# Altium project main board_Project.PrjPCB
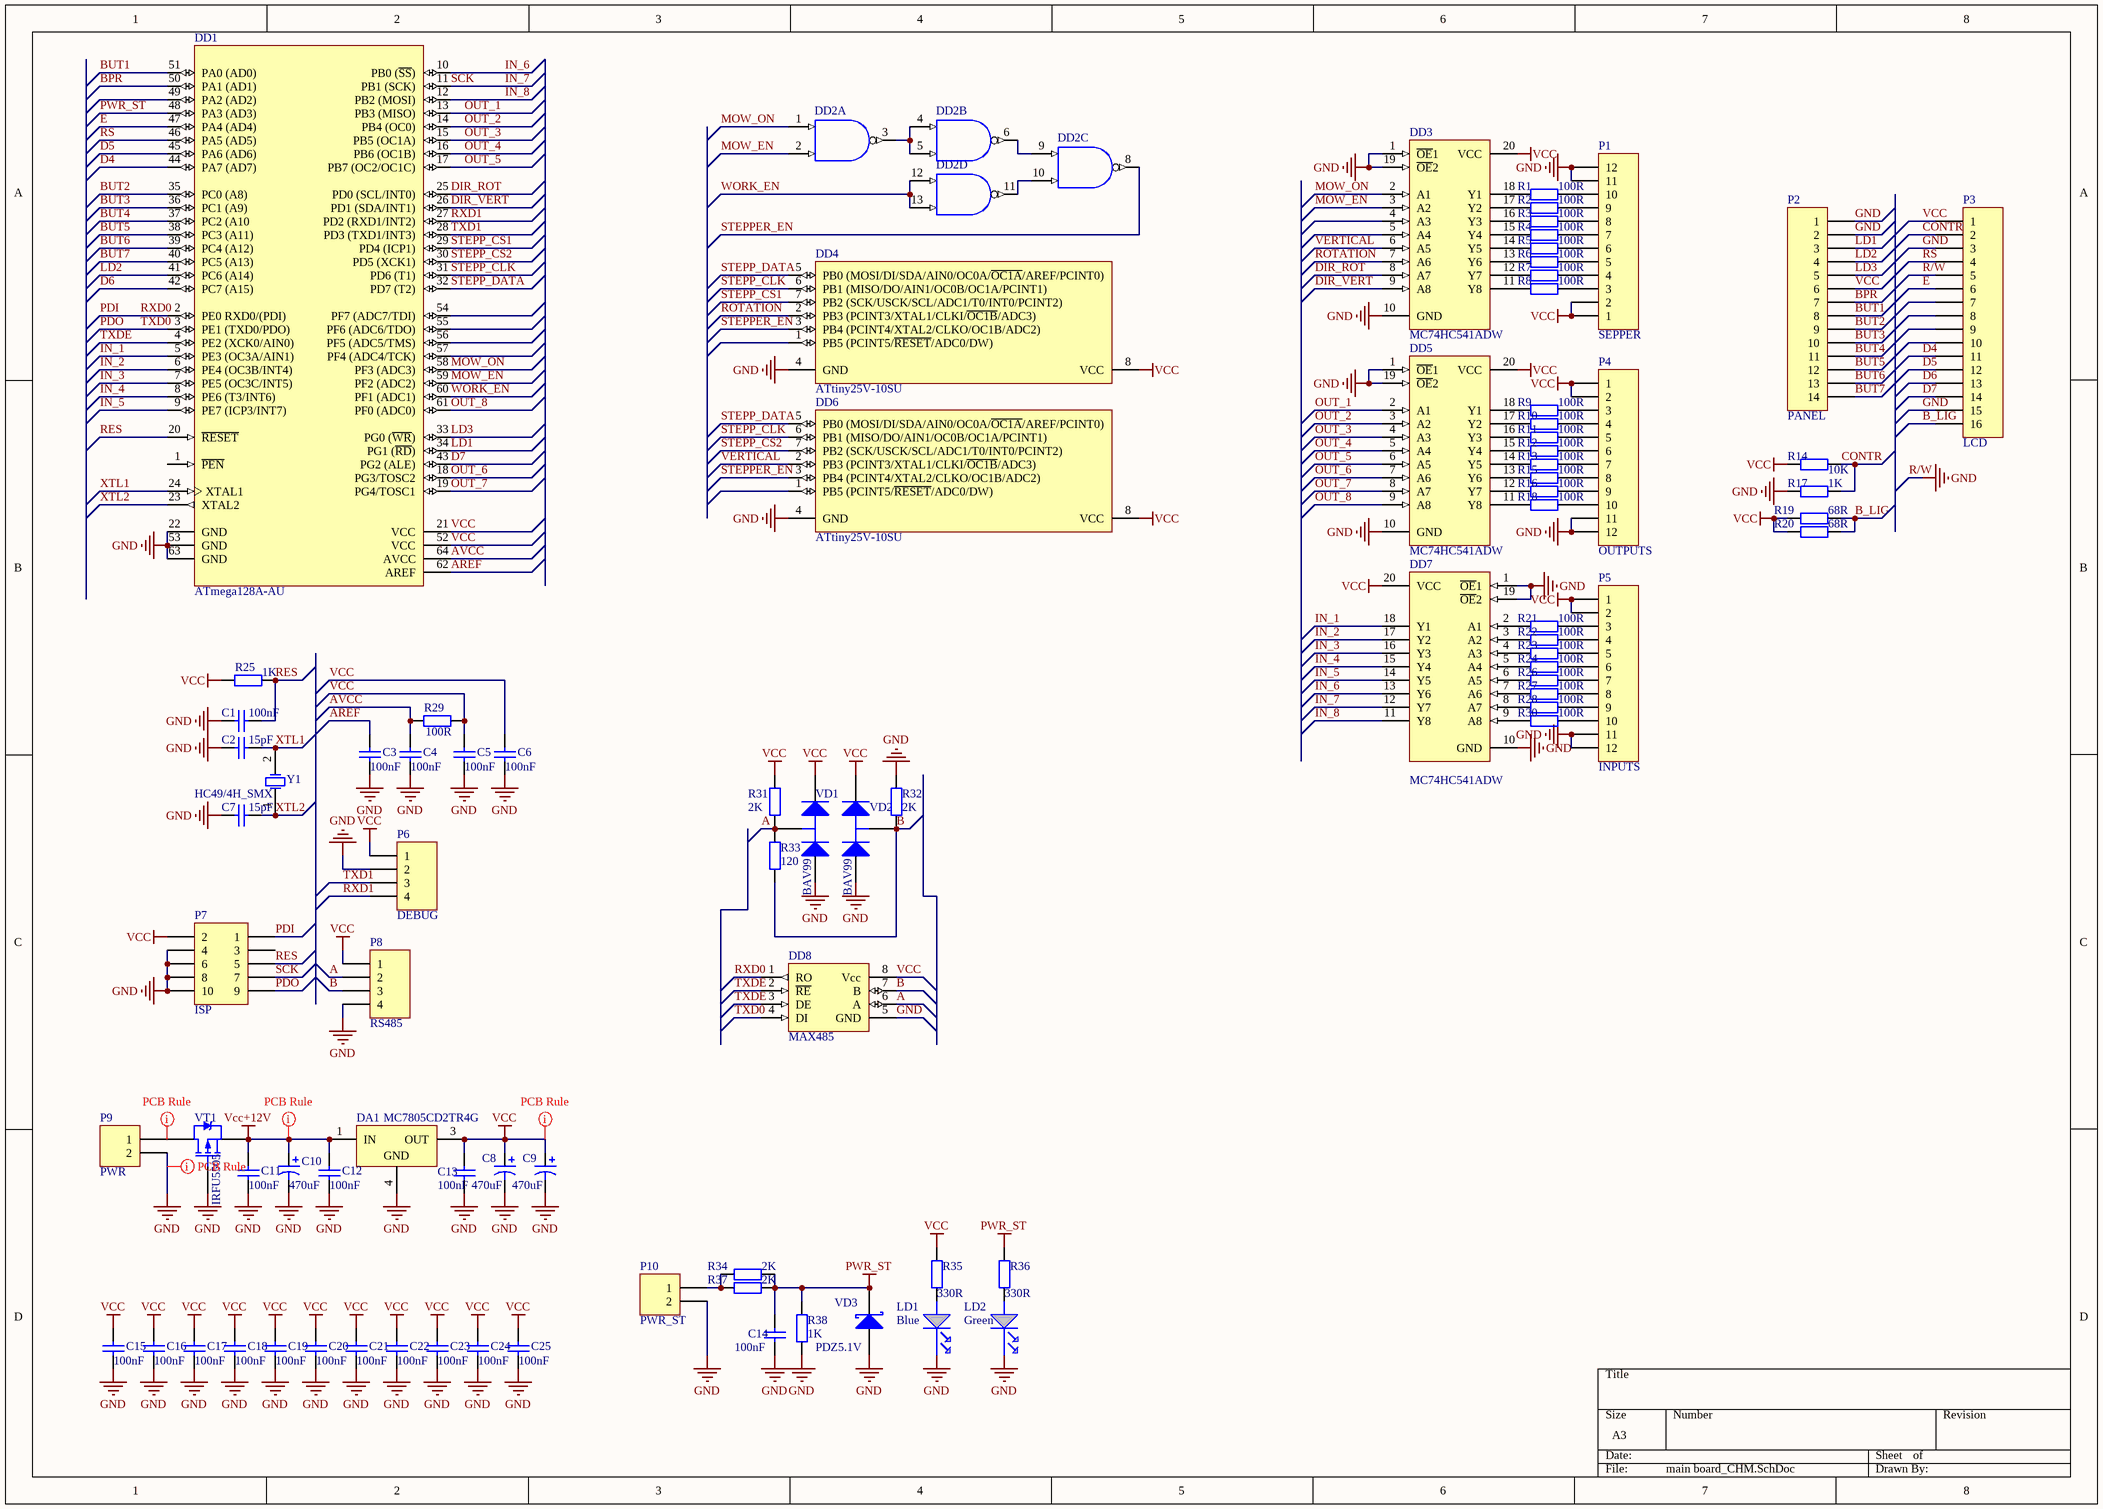
[diagram p0: main board_CHM.SchDoc]
1 sheet, 89 parts. Net scope: global (net labels, ports and power ports of the same name join across sheets).
Board file: main board_PCB.PcbDoc

## Sheet main board_CHM.SchDoc
size A3; PageSetup: Record=PageOptions|CenterHorizontal=True|CenterVertical=True|PrintScale=1.03|XCorrection=1.00|YCorrection=1.00|PrintKind=1|BorderSize=5000000|LeftOffset=0|BottomOffset=0|Orientation=2|PaperLength=1000|PaperWidth=1000|Scale=100|PaperSource=15|PrintQuality=600|MediaType=1|DitherType=10|PaperKind=A3|PrintScaleMode=1

### Parts
C1  value 100nF  [CAPC2012X135N]  (hidden comment: C0805)
C2  value 15pF  [CAPC2012X135N]  (hidden comment: C0805)
C3  value 100nF  [CAPC2012X135N]  (hidden comment: C0805)
C4  value 100nF  [CAPC2012X135N]  (hidden comment: C0805)
C5  value 100nF  [CAPC2012X135N]  (hidden comment: C0805)
C6  value 100nF  [CAPC2012X135N]  (hidden comment: C0805)
C7  value 15pF  [CAPC2012X135N]  (hidden comment: C0805)
C8  value 470uF  [CAPAE200P550X1200_FLAT1]  (hidden comment: Cap Pol1)
C9  value 470uF  [CAPAE200P550X1200_FLAT1]  (hidden comment: Cap Pol1)
C10  value 470uF  [CAPAE200P550X1200_FLAT1]  (hidden comment: Cap Pol1)
C11  value 100nF  [CAPC2012X135N]  (hidden comment: C0805)
C12  value 100nF  [CAPC2012X135N]  (hidden comment: C0805)
C13  value 100nF  [CAPC2012X135N]  (hidden comment: C0805)
C14  value 100nF  [CAPC2012X135N]  (hidden comment: C0805)
C15  value 100nF  [CAPC2012X135N]  (hidden comment: C0805)
C16  value 100nF  [CAPC2012X135N]  (hidden comment: C0805)
C17  value 100nF  [CAPC2012X135N]  (hidden comment: C0805)
C18  value 100nF  [CAPC2012X135N]  (hidden comment: C0805)
C19  value 100nF  [CAPC2012X135N]  (hidden comment: C0805)
C20  value 100nF  [CAPC2012X135N]  (hidden comment: C0805)
C21  value 100nF  [CAPC2012X135N]  (hidden comment: C0805)
C22  value 100nF  [CAPC2012X135N]  (hidden comment: C0805)
C23  value 100nF  [CAPC2012X135N]  (hidden comment: C0805)
C24  value 100nF  [CAPC2012X135N]  (hidden comment: C0805)
C25  value 100nF  [CAPC2012X135N]  (hidden comment: C0805)
DA1  MC7805CD2TR4G  [TO-252]
DD1  ATmega128A-AU  [64A_N]
DD2  MC74HC00AD  [SOIC127P600X175-14AN]  (value not drawn)  (parts A,B,C,D of 4)
DD3  MC74HC541ADW  [751D-05_N]
DD4  ATtiny25V-10SU  [8S2_N]
DD5  MC74HC541ADW  [751D-05_N]
DD6  ATtiny25V-10SU  [8S2_N]
DD7  MC74HC541ADW  [751D-05_N]
DD8  MAX485  [S8S1_M]
LD1  value Blue  [LED-0603-BLUE]  (hidden comment: PWR_L)
LD2  value Green  [LED-0603-GREEN]  (hidden comment: PWR_H)
P1  SEPPER  [12P_PCB_ScrewTerm_90S_3.81MM]
P2  PANEL  [14P_PCB_HEADER_BRD_MNT]
P3  LCD  [16P_PCB_HEADER_BRD_MNT]
P4  OUTPUTS  [12P_PCB_ScrewTerm_90S_3.81MM]
P5  INPUTS  [12P_PCB_ScrewTerm_90S_3.81MM]
P6  DEBUG  [HDR1X4]
P7  ISP  [10P_PCB_HEADER_BRD_MNT]
P8  RS485  [4P_PCB_ScrewTerm_90S_3.81MM]
P9  PWR  [2P_PCB_ScrewTerm_90S_3.81MM]
P10  PWR_ST  [2P_PCB_ScrewTerm_90S_3.81MM]
R1  value 100R  [RESC3216X70N]  (hidden comment: Res2)
R2  value 100R  [RESC3216X70N]  (hidden comment: Res2)
R3  value 100R  [RESC3216X70N]  (hidden comment: Res2)
R4  value 100R  [RESC3216X70N]  (hidden comment: Res2)
R5  value 100R  [RESC3216X70N]  (hidden comment: Res2)
R6  value 100R  [RESC3216X70N]  (hidden comment: Res2)
R7  value 100R  [RESC3216X70N]  (hidden comment: Res2)
R8  value 100R  [RESC3216X70N]  (hidden comment: Res2)
R9  value 100R  [RESC3216X70N]  (hidden comment: Res2)
R10  value 100R  [RESC3216X70N]  (hidden comment: Res2)
R11  value 100R  [RESC3216X70N]  (hidden comment: Res2)
R12  value 100R  [RESC3216X70N]  (hidden comment: Res2)
R13  value 100R  [RESC3216X70N]  (hidden comment: Res2)
R14  value 10K  [RESC2012X70N]  (hidden comment: Res2)
R15  value 100R  [RESC3216X70N]  (hidden comment: Res2)
R16  value 100R  [RESC3216X70N]  (hidden comment: Res2)
R17  value 1K  [RESC2012X70N]  (hidden comment: Res2)
R18  value 100R  [RESC3216X70N]  (hidden comment: Res2)
R19  value 68R  [RESC3216X70N]  (hidden comment: Res2)
R20  value 68R  [RESC3216X70N]  (hidden comment: Res2)
R21  value 100R  [RESC3216X70N]  (hidden comment: Res2)
R22  value 100R  [RESC3216X70N]  (hidden comment: Res2)
R23  value 100R  [RESC3216X70N]  (hidden comment: Res2)
R24  value 100R  [RESC3216X70N]  (hidden comment: Res2)
R25  value 1K  [RESC2012X70N]  (hidden comment: Res2)
R26  value 100R  [RESC3216X70N]  (hidden comment: Res2)
R27  value 100R  [RESC3216X70N]  (hidden comment: Res2)
R28  value 100R  [RESC3216X70N]  (hidden comment: Res2)
R29  value 100R  [RESC2012X70N]  (hidden comment: Res2)
R30  value 100R  [RESC3216X70N]  (hidden comment: Res2)
R31  value 2K  [RESC2012X70N]  (hidden comment: Res2)
R32  value 2K  [RESC2012X70N]  (hidden comment: Res2)
R33  value 120  [RESC2012X70N]  (hidden comment: Res2)
R34  value 2K  [RESC3216X70N]  (hidden comment: Res2)
R35  value 330R  [RESC2012X70N]  (hidden comment: Res2)
R36  value 330R  [RESC2012X70N]  (hidden comment: Res2)
R37  value 2K  [RESC3216X70N]  (hidden comment: Res2)
R38  value 1K  [RESC2012X70N]  (hidden comment: Res2)
VD1  BAV99  [SOT23-3]
VD2  BAV99  [SOT23-3]
VD3  PDZ5.1V  [SOD323]
VT1  IRFU5505  [TO-252]
Y1  HC49/4H_SMX  [CRYSTAL_HC49-US-SM]

### Nets
GND: C1.1 C2.1 C3.1 C4.1 C5.1 C6.1 C7.1 C8.2 C9.2 C10.2 C11.1 C12.1 C13.1 C14.1 C15.1 C16.1 C17.1 C18.1 C19.1 C20.1 C21.1 C22.1 C23.1 C24.1 C25.1 DA1.4(GND) DD1.22(GND) DD1.53(GND) DD1.63(GND) DD2.7(GND) DD3.1(~{OE}1) DD3.10(GND) DD3.19(~{OE}2) DD4.4(GND) DD5.1(~{OE}1) DD5.10(GND) DD5.19(~{OE}2) DD6.4(GND) DD7.1(~{OE}1) DD7.10(GND) DD7.19(~{OE}2) DD8.5(GND) LD1.K(CATODE) LD2.K(CATODE) P1.11 P1.12 P2.1 P2.2 P3.3 P3.5 P3.15 P4.11 P4.12 P5.11 P5.12 P6.2 P7.4 P7.6 P7.8 P7.10 P8.4 P9.2 P10.2 R17.1 R32.1 R38.1 VD1.1(A) VD2.1(A) VD3.2(A) VT1.1(G)  [also labelled R/W]
PWR_ST: C14.2 DD1.48(PA3_(AD3)) R34.2 R36.2 R37.2 R38.2 VD3.1(K)
VCC: C5.2 C6.2 C8.1 C9.1 C13.2 C15.2 C16.2 C17.2 C18.2 C19.2 C20.2 C21.2 C22.2 C23.2 C24.2 C25.2 DA1.3(OUT) DD1.21(VCC) DD1.52(VCC) DD2.14(VCC) DD3.20(VCC) DD4.8(VCC) DD5.20(VCC) DD6.8(VCC) DD7.20(VCC) DD8.8(Vcc) P1.1 P1.2 P2.6 P3.1 P4.1 P4.2 P5.1 P5.2 P6.1 P7.2 P8.1 R14.1 R19.1 R20.1 R25.1 R29.2 R31.2 R35.2 VD1.2(K) VD2.2(K)
Vcc+12V: C10.1 C11.2 C12.2 DA1.1(IN) VT1.3(S)
A: DD8.6(A) P8.2 R31.1 R33.1 VD1.3(C)
AREF: C3.2 DD1.62(AREF)
AVCC: C4.2 DD1.64(AVCC) R29.1
B: DD8.7(B) P8.3 R32.2 R33.2 VD2.3(C)
B_LIG: P3.16 R19.2 R20.2
BPR: DD1.50(PA1_(AD1)) P2.7
BUT1: DD1.51(PA0_(AD0)) P2.8
BUT2: DD1.35(PC0_(A8)) P2.9
BUT3: DD1.36(PC1_(A9)) P2.10
BUT4: DD1.37(PC2_(A10) P2.11
BUT5: DD1.38(PC3_(A11)) P2.12
BUT6: DD1.39(PC4_(A12)) P2.13
BUT7: DD1.40(PC5_(A13)) P2.14
CONTR: P3.2 R14.2 R17.2
D4: DD1.44(PA7_(AD7)) P3.11
D5: DD1.45(PA6_(AD6)) P3.12
D6: DD1.42(PC7_(A15)) P3.13
D7: DD1.43(PG2_(ALE)) P3.14
DIR_ROT: DD1.25(PD0_(SCL/INT0)) DD3.8(A7)
DIR_VERT: DD1.26(PD1_(SDA/INT1)) DD3.9(A8)
E: DD1.47(PA4_(AD4)) P3.6
IN_1: DD1.5(PE3_(OC3A/AIN1)) DD7.18(Y1)
IN_2: DD1.6(PE4_(OC3B/INT4)) DD7.17(Y2)
IN_3: DD1.7(PE5_(OC3C/INT5)) DD7.16(Y3)
IN_4: DD1.8(PE6_(T3/INT6)) DD7.15(Y4)
IN_5: DD1.9(PE7_(ICP3/INT7)) DD7.14(Y5)
IN_6: DD1.10(PB0_(~{SS})) DD7.13(Y6)
IN_7: DD1.11(PB1_(SCK)) DD7.12(Y7) P7.7  [also labelled SCK]
IN_8: DD1.12(PB2_(MOSI)) DD7.11(Y8)
LD1: DD1.34(PG1_(~{RD})) P2.3
LD2: DD1.41(PC6_(A14)) P2.4
LD3: DD1.33(PG0_(~{WR})) P2.5
MOW_EN: DD1.59(PF2_(ADC2)) DD2.2(B) DD3.3(A2)
MOW_ON: DD1.58(PF3_(ADC3)) DD2.1(A) DD3.2(A1)
OUT_1: DD1.13(PB3_(MISO)) DD5.2(A1)
OUT_2: DD1.14(PB4_(OC0)) DD5.3(A2)
OUT_3: DD1.15(PB5_(OC1A)) DD5.4(A3)
OUT_4: DD1.16(PB6_(OC1B)) DD5.5(A4)
OUT_5: DD1.17(PB7_(OC2/OC1C)) DD5.6(A5)
OUT_6: DD1.18(PG3/TOSC2) DD5.7(A6)
OUT_7: DD1.19(PG4/TOSC1) DD5.8(A7)
OUT_8: DD1.61(PF0_(ADC0)) DD5.9(A8)
PDI: DD1.2(PE0_RXD0/(PDI)) DD8.1(RO) P7.1  [also labelled RXD0]
PDO: DD1.3(PE1_(TXD0/PDO)) DD8.4(DI) P7.9  [also labelled TXD0]
RES: C1.2 DD1.20(~{RESET}) P7.5 R25.2
ROTATION: DD3.7(A6) DD4.2(PB3_(PCINT3/XTAL1/CLKI/~{OC1B}/ADC3))
RS: DD1.46(PA5_(AD5)) P3.4
RXD1: DD1.27(PD2_(RXD1/INT2)) P6.4
STEPP_CLK: DD1.31(PD6_(T1)) DD4.6(PB1_(MISO/DO/AIN1/OC0B/OC1A/PCINT1)) DD6.6(PB1_(MISO/DO/AIN1/OC0B/OC1A/PCINT1))
STEPP_CS1: DD1.29(PD4_(ICP1)) DD4.7(PB2_(SCK/USCK/SCL/ADC1/T0/INT0/PCINT2))
STEPP_CS2: DD1.30(PD5_(XCK1)) DD6.7(PB2_(SCK/USCK/SCL/ADC1/T0/INT0/PCINT2))
STEPP_DATA: DD1.32(PD7_(T2)) DD4.5(PB0_(MOSI/DI/SDA/AIN0/OC0A/~{OC1A}/AREF/PCINT0)) DD6.5(PB0_(MOSI/DI/SDA/AIN0/OC0A/~{OC1A}/AREF/PCINT0))
STEPPER_EN: DD2.8(~{Y}) DD4.3(PB4_(PCINT4/XTAL2/CLKO/OC1B/ADC2)) DD6.3(PB4_(PCINT4/XTAL2/CLKO/OC1B/ADC2))
TXD1: DD1.28(PD3_(TXD1/INT3)) P6.3
TXDE: DD1.4(PE2_(XCK0/AIN0)) DD8.2(~{RE}) DD8.3(DE)
VERTICAL: DD3.6(A5) DD6.2(PB3_(PCINT3/XTAL1/CLKI/~{OC1B}/ADC3))
WORK_EN: DD1.60(PF1_(ADC1)) DD2.12(A) DD2.13(B)
XTL1: C2.2 DD1.24(XTAL1) Y1.2(OSC2)
XTL2: C7.2 DD1.23(XTAL2) Y1.1(OSC1)
NetDD2_3: DD2.3(~{Y}) DD2.4(A) DD2.5(B)
NetDD2_6: DD2.6(~{Y}) DD2.9(A)
NetDD2_10: DD2.10(B) DD2.11(~{Y})
NetDD3_11: DD3.11(Y8) R8.1
NetDD3_12: DD3.12(Y7) R7.1
NetDD3_13: DD3.13(Y6) R6.1
NetDD3_14: DD3.14(Y5) R5.1
NetDD3_15: DD3.15(Y4) R4.1
NetDD3_16: DD3.16(Y3) R3.1
NetDD3_17: DD3.17(Y2) R2.1
NetDD3_18: DD3.18(Y1) R1.1
NetDD5_11: DD5.11(Y8) R18.1
NetDD5_12: DD5.12(Y7) R16.1
NetDD5_13: DD5.13(Y6) R15.1
NetDD5_14: DD5.14(Y5) R13.1
NetDD5_15: DD5.15(Y4) R12.1
NetDD5_16: DD5.16(Y3) R11.1
NetDD5_17: DD5.17(Y2) R10.1
NetDD5_18: DD5.18(Y1) R9.1
NetDD7_2: DD7.2(A1) R21.1
NetDD7_3: DD7.3(A2) R22.1
NetDD7_4: DD7.4(A3) R23.1
NetDD7_5: DD7.5(A4) R24.1
NetDD7_6: DD7.6(A5) R26.1
NetDD7_7: DD7.7(A6) R27.1
NetDD7_8: DD7.8(A7) R28.1
NetDD7_9: DD7.9(A8) R30.1
NetLD1_A: LD1.A(ANODE) R35.1
NetLD2_A: LD2.A(ANODE) R36.1
NetP1_3: P1.3 R8.2
NetP1_4: P1.4 R7.2
NetP1_5: P1.5 R6.2
NetP1_6: P1.6 R5.2
NetP1_7: P1.7 R4.2
NetP1_8: P1.8 R3.2
NetP1_9: P1.9 R2.2
NetP1_10: P1.10 R1.2
NetP4_3: P4.3 R9.2
NetP4_4: P4.4 R10.2
NetP4_5: P4.5 R11.2
NetP4_6: P4.6 R12.2
NetP4_7: P4.7 R13.2
NetP4_8: P4.8 R15.2
NetP4_9: P4.9 R16.2
NetP4_10: P4.10 R18.2
NetP5_3: P5.3 R21.2
NetP5_4: P5.4 R22.2
NetP5_5: P5.5 R23.2
NetP5_6: P5.6 R24.2
NetP5_7: P5.7 R26.2
NetP5_8: P5.8 R27.2
NetP5_9: P5.9 R28.2
NetP5_10: P5.10 R30.2
NetP9_1: P9.1 VT1.2(D)
NetP10_1: P10.1 R34.1 R37.1

Not connected (* = marked no-connect by the designer): DD1 1(~{PEN}) 49(PA2_(AD2)) 54(PF7_(ADC7/TDI)) 55(PF6_(ADC6/TDO)) 56(PF5_(ADC5/TMS)) 57(PF4_(ADC4/TCK)); DD3 4(A3) 5(A4); DD4 1(PB5_(PCINT5/~{RESET}/ADC0/DW)); DD6 1(PB5_(PCINT5/~{RESET}/ADC0/DW)); P3 7 8 9 10; P7 3

### Layout directives
rule Width Constraint [Pref Width = 40mil    Min Width = 10mil    Max Width = 40mil]: GND, NetP9_1, VCC, Vcc+12V

### Library data of the parts
C1-C7 C11-C25 = C0805: Ceramic Chip Capacitor - Standard; Note: Footprint corresponds to dimensions for bulk cassette packaging. This case size has tightened tolerances.; Published: 17-Jul-2002; LatestRevisionDate: 19-Mar-2004; LatestRevisionNote: Silkscreen size reduced.; DatasheetDocument: Mar-2001; PackageDocument: Mar-2001; PackageReference: 0805; Publisher: Altium Limited; Code_JEITA: 0805; Code_IPC: 2012[0805]; ComponentLink1Description: Manufacturer Link; ComponentLink1URL: http://www.kemet.com/; ComponentLink2Description: Datasheet; ComponentLink2URL: http://www.kemet.com/kemet/web/homepage/kechome.nsf/vapubfilesname/F3102TA.pdf/$file/F3102TA.pdf
C8-C10 = Cap Pol1: Polarized Capacitor (Radial); Published: 8-Jun-2000; LatestRevisionDate: 17-Jul-2002; LatestRevisionNote: Re-released for DXP Platform.; PackageReference: RB7.6-15; Publisher: Altium Limited; PackageDescription: Polarized Capacitor (Radial); 2 Leads
DA1 = µA78M05CKTPR: Positive-Voltage Regulator; Note: Pin 2 is electrically connected to pin4, and not drawn.; Published: 15-Apr-2002; DatasheetVersion: Jul-1999; PackageVersion: Jan-2001; PackageReference: KTP02; Publisher: Altium Limited; PackageDescription: PowerFLEX (D-PAK/TO-252-AA); 3 Leads (1 Cropped); Body 9.7 (inc. leads) x 6.2 mm (LxW max); Code_JEDEC: TO-252; ComponentLink1Description: Manufacturer Link; ComponentLink1URL: http://www.ti.com/; ComponentLink2Description: Datasheet; ComponentLink2URL: http://www-s.ti.com/sc/ds/ua78m05.pdf
DD1 = ATmega128A-AU: 8-bit AVR Microcontroller, 128KB Flash, 4KB EEPROM, 4KB SRAM, 64-pin TQFP, Industrial Grade (-40°C to 85°C); Published: 1-Apr-2010; DatasheetVersion: revE, Feb-2010; PackageVersion: revB, Oct-2001; PackageReference: 64A; Publisher: Altium Limited; PackageDescription: 64-Pin Plastic Thin Profile Quad Flat Pack, 14 x 14 x 1.0 mm Body, 0.8 mm Pitch (TQFP); Supplier 1: Digi-Key; Supplier Part Number 1: ATMEGA128A-AU-ND; Supplier 2: Farnell; Supplier Part Number 2: 1773397; Supplier 3: Mouser; Supplier Part Number 3: 556-ATMEGA128A-AU; Code_JEDEC: MS-026-AEB; ComponentLink1Description: Manufacturer Link; ComponentLink1URL: http://www.atmel.com/products/avr/default.asp?; ComponentLink2Description: ATmega128A Datasheet; ComponentLink2URL: http://www.atmel.com/dyn/resources/prod_documents/doc8151.pdf; ComponentLink3Description: ATmega128A Summary; ComponentLink3URL: http://www.atmel.com/dyn/resources/prod_documents/8151S.pdf; ComponentLink4Description: Atmel.com Home; ComponentLink4URL: http://www.atmel.com
DD2 = MC74HC00AD: Quad 2-Input NAND Gate; Published: 15-Apr-2002; LatestRevisionDate: 13-Apr-2006; LatestRevisionNote: IPC-7351 Footprint Added.; DatasheetVersion: Mar-2000; PackageReference: 751A-03; Publisher: Altium Limited; PackageDescription: 14-Pin Small Outline Integrated Circuit 1.27 mm Pitch; Code_JEDEC: MS-012-AB; Code_IPC: SOIC127P600-14; ComponentLink1Description: Manufacturer Link; ComponentLink1URL: http://www.onsemi.com/; ComponentLink2Description: Datasheet; ComponentLink2URL: http://www.onsemi.com/pub/Collateral/MC74HC00A-D.PDF
DD3 DD5 DD7 = MC74HC541ADW: Octal 3-State Non-Inverting Buffer/Line Driver/Line Receiver; Published: 15-Apr-2002; LatestRevisionDate: 13-Apr-2006; LatestRevisionNote: IPC-7351 Footprint Added.; DatasheetVersion: Mar-2000; PackageReference: 751D-05; Publisher: Altium Limited; PackageDescription: 20-Pin Small Outline Integrated Circuit 1.27 mm Pitch; ComponentLink1Description: Manufacturer Link; ComponentLink1URL: http://www.onsemi.com/; ComponentLink2Description: Datasheet; ComponentLink2URL: http://www.onsemi.com/pub/Collateral/MC74HC541A-D.PDF
DD4 DD6 = ATtiny25V-10SU: 8-bit AVR Microcontroller, 1.8-5.5V, 2KB Flash, 128 Bytes EEPROM, 128 Bytes SRAM, 8-pin SOP, Industrial Grade (-40°C to 85°C), Pb-Free; Published: 1-Apr-2010; DatasheetVersion: revK, Jan-2008; PackageVersion: revF, Apr-2008; PackageReference: 8S2; Publisher: Altium Limited; PackageDescription: 8-Lead, 0.208" Body, Plastic Small Outline Package (EIAJ); Supplier 1: Digi-Key; Supplier Part Number 1: ATTINY25V-10SU-ND; Supplier 2: Farnell; Supplier Part Number 2: 1455145; Supplier 3: Mouser; Supplier Part Number 3: 556-ATTINY25V10SU; ComponentLink1Description: Manufacturer Link; ComponentLink1URL: http://www.atmel.com/products/avr/default.asp?; ComponentLink2Description: ATtiny25/45/85 Datasheet; ComponentLink2URL: http://www.atmel.com/dyn/resources/prod_documents/doc2586.pdf; ComponentLink3Description: ATtiny25/45/85 Summary; ComponentLink3URL: http://www.atmel.com/dyn/resources/prod_documents/2586S.pdf; ComponentLink4Description: Atmel.com Home; ComponentLink4URL: http://www.atmel.com
DD8 = ST485
LD1 LD2 = LED: APT1608QBC/D
P1 P4 P5 = Header 12: Header, 12-Pin; LatestRevisionDate: 17-Jul-2002; LatestRevisionNote: Re-released for DXP Platform.; Publisher: Altium Limited
P2 = Header 14: Header, 14-Pin; LatestRevisionDate: 17-Jul-2002; LatestRevisionNote: Re-released for DXP Platform.; Publisher: Altium Limited
P3 = Header 16: Header, 16-Pin; LatestRevisionDate: 17-Jul-2002; LatestRevisionNote: Re-released for DXP Platform.; Publisher: Altium Limited
P6 = Header 4: Header, 4-Pin; LatestRevisionDate: 17-Jul-2002; LatestRevisionNote: Re-released for DXP Platform.; Publisher: Altium Limited
P7 = Header 5X2: Header, 5-Pin, Dual row; LatestRevisionDate: 17-Jul-2002; LatestRevisionNote: Re-released for DXP Platform.; Publisher: Altium Limited
P8 = MHDR1X4: Header, 4-Pin; LatestRevisionDate: 17-Jul-2002; LatestRevisionNote: Re-released for DXP Platform.; Publisher: Altium Limited
P9 P10 = Header 2H: Header, 2-Pin, Right Angle; LatestRevisionDate: 17-Jul-2002; LatestRevisionNote: Re-released for DXP Platform.; Publisher: Altium Limited
R1-R38 = Res2: Resistor; Published: 8-Jun-2000; LatestRevisionDate: 17-Jul-2002; LatestRevisionNote: Re-released for DXP Platform.; PackageReference: AXIAL-0.4; Publisher: Altium Limited; PackageDescription: Axial Device, Thru-Hole; 2 Leads; 0.4 in Pin Spacing
VD1 VD2 = BAV99: Silicon Switching Diode Array for High-Speed Switching; Published: 21-Mar-2003; DatasheetDocument: Oct-1999; PackageDocument: Sep-2001; PackageReference: SOT-23; Publisher: Altium Limited; ComponentLink1Description: Manufacturer Link; ComponentLink1URL: http://www.infineon.com/; ComponentLink2Description: Datasheet; ComponentLink2URL: http://www.infineon.com/upload/Document/cmc_upload/documents/080/631/bav99series_1.pdf
VD3 = BAS170W: Silicon AF Schottky Diode for High-Speed Switching; pin to pad: 1>K 2>A; Published: 21-Mar-2003; LatestRevisionDate: 19-Mar-2004; LatestRevisionNote: Silkscreen size reduced.; DatasheetDocument: Oct-1999; PackageDocument: Sep-2000; PackageReference: SOD-323; Publisher: Altium Limited; ComponentLink1Description: Manufacturer Link; ComponentLink1URL: http://www.infineon.com/; ComponentLink2Description: Datasheet; ComponentLink2URL: http://www.infineon.com/upload/Document/cmc_upload/documents/009/379/bas70_bas170series_1.pdf
VT1 = IRFU5505: HEXFET Power MOSFET; pin to pad: 2>4; Note: Pin 2 is electrically connected to pin 4.; Published: 8-Jun-2000; LatestRevisionDate: 17-Jul-2002; LatestRevisionNote: Re-released for DXP Platform.; DatasheetVersion: Aug-1997; PackageReference: TO-251AA; Publisher: Altium Limited; PackageDescription: TO, Thru-Hole, Vertical, Heatsink Mounted; 3 In-Line Leads; Pitch 2.28 mm; ComponentLink1Description: Manufacturer Link; ComponentLink1URL: http://www.irf.com/; ComponentLink2Description: Datasheet; ComponentLink2URL: http://www.irf.com/product-info/datasheets/data/irfr5505.pdf
Y1 = HC49/4H_SMX: Surface Mount Quartz Crystal; Note: PCB layout complies with manufacturer's recommendation.; Published: 17-Jul-2002; DatasheetDocument: 18-Oct-1999; PackageDocument: 18-Oct-1999; PackageReference: HC49/4H_SMX; Publisher: Altium Limited; ComponentLink1Description: Manufacturer Link; ComponentLink1URL: http://www.cmac.com/mt/; ComponentLink2Description: Datasheet; ComponentLink2URL: http://www.cmac.com/mt/databook/crystals/smd/hc49_4h_smx.pdf